# EAGLE design Zio Qwiic Relay (EAGLE 9.1.1)
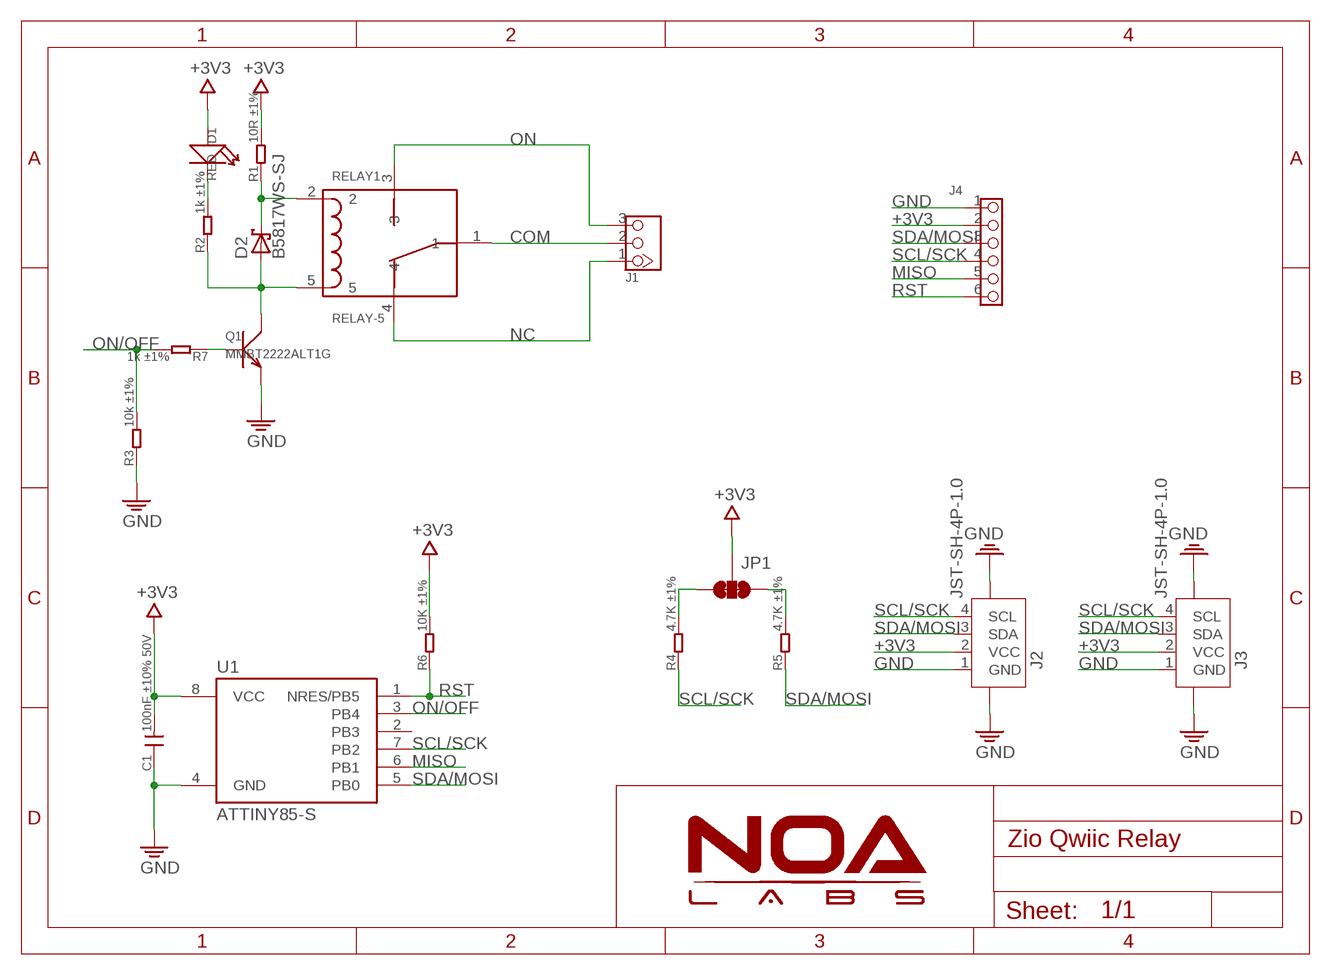
[diagram p0: schematic, sheet 1]

## Parts
C1  100nF ±10% 50V  C-0603  [C0603]
D1  RED  LED'0603'  [LED-0603]
D2  B5817WS-SJ  SCHOTTKY-SOD323  [SOD323]
J1  HEADER-3P  [3P-SCREW-5.08]
J2  JST-SH-4P-1.0  [JST-SH-4P]
J3  JST-SH-4P-1.0  [JST-SH-4P]
J4  HEADER-6P-60/35MIL  [6P-2.54-60/35MIL]
JP1  SMT-JUMPER_3_2-NC_TRACE  [SMT-JUMPER_3_2-NC_TRACE]
Q1  MMBT2222ALT1G  TRANSISTOR-NPN-SOT23''  [SOT23]
R1  10R ±1%  R-0603  [R0603]
R2  1k ±1%  R-0603  [R0603]
R3  10k ±1%  R-0603  [R0603]
R4  4.7K ±1%  R-0603  [R0603]
R5  4.7K ±1%  R-0603  [R0603]
R6  10K ±1%  R-0603  [R0603]
R7  1k ±1%  R-0603  [R0603]
RELAY1  RELAY-5  [RELAY-5]
U1  ATTINY85-S  [SOIC8_EIAJ_208MIL]

## Nets
+3V3: C1.2 D1.+ J2.2(VCC) J3.2(VCC) J4.2 JP1.2 R1.2 R6.2 U1.8(VCC)
COM: J1.2 RELAY1.1
GND: C1.1 J2.1(GND) J2.NC1 J2.NC2 J3.1(GND) J3.NC1 J3.NC2 J4.1 Q1.2(E) R3.1 U1.4(GND)
MISO: J4.5 U1.6(PB1)
N$1: D2.-(C) R1.1 RELAY1.2
N$2: Q1.1(B) R7.1
N$3: D1.- R2.2
N$4: D2.+(A) Q1.3(C) R2.1 RELAY1.5
N$6: JP1.3 R4.2
N$8: JP1.1 R5.2
NC: J1.1 RELAY1.4
ON: J1.3 RELAY1.3
ON/OFF: R3.2 R7.2 U1.3(PB4)
RST: J4.6 R6.1 U1.1(NRES/PB5)
SCL/SCK: J2.4(SCL) J3.4(SCL) J4.4 R4.1 U1.7(PB2)
SDA/MOSI: J2.3(SDA) J3.3(SDA) J4.3 R5.1 U1.5(PB0)
Unconnected: U1.2(PB3)

## Library data of the parts
C1 = RCL:C
D1 = Discrete_NOA:LED*
D2 = Discrete_NOA:SCHOTTKY
J1 = Connector_NOA:HEADER-3P
J2 J3 = Connector:JST-SH-4P
J4 = Connector_NOA:HEADER-6P
JP1 = NOA-Jumpers:SMT-JUMPER_3_2-NC_TRACE
Q1 = Discrete_NOA:TRANSISTOR-NPN*: NPN audion
R1-R7 = RCL:R
RELAY1 = Discrete:RELAY-5
U1 = IC:ATTINY85*: ATMEL ATtiny 85 Packages: P = PDIP 08 30mil S = SOIC 08 EIAJ 208mil Technologies Note: for complete ordering code (temp. range, finish, tape&reel etc.) see www.atmel.com • Supply Voltage: V = (1.8…5.5)V | [blank] = (2.7…5.5)V • Speed: 10 = 10 MHz | 20 = 20 MHz Author: Dipl.-Ing. FH Rainer Bayer HHN Hochschule Heilbronn (Heilbronn University), rainer.bayer@hs-heilbronn.de Ingenieurbüro ing-rb, mail@ing-rb.de

## Board
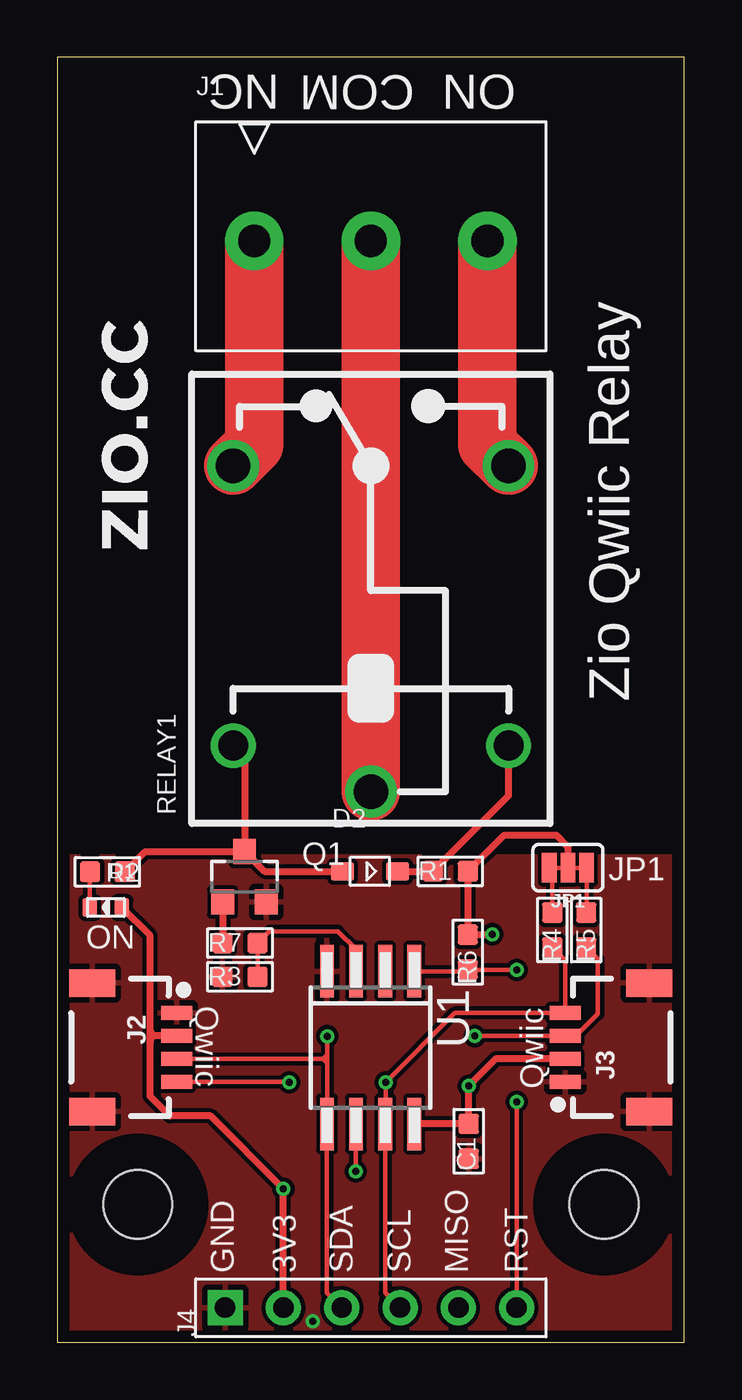
[diagram p1: board, top side]
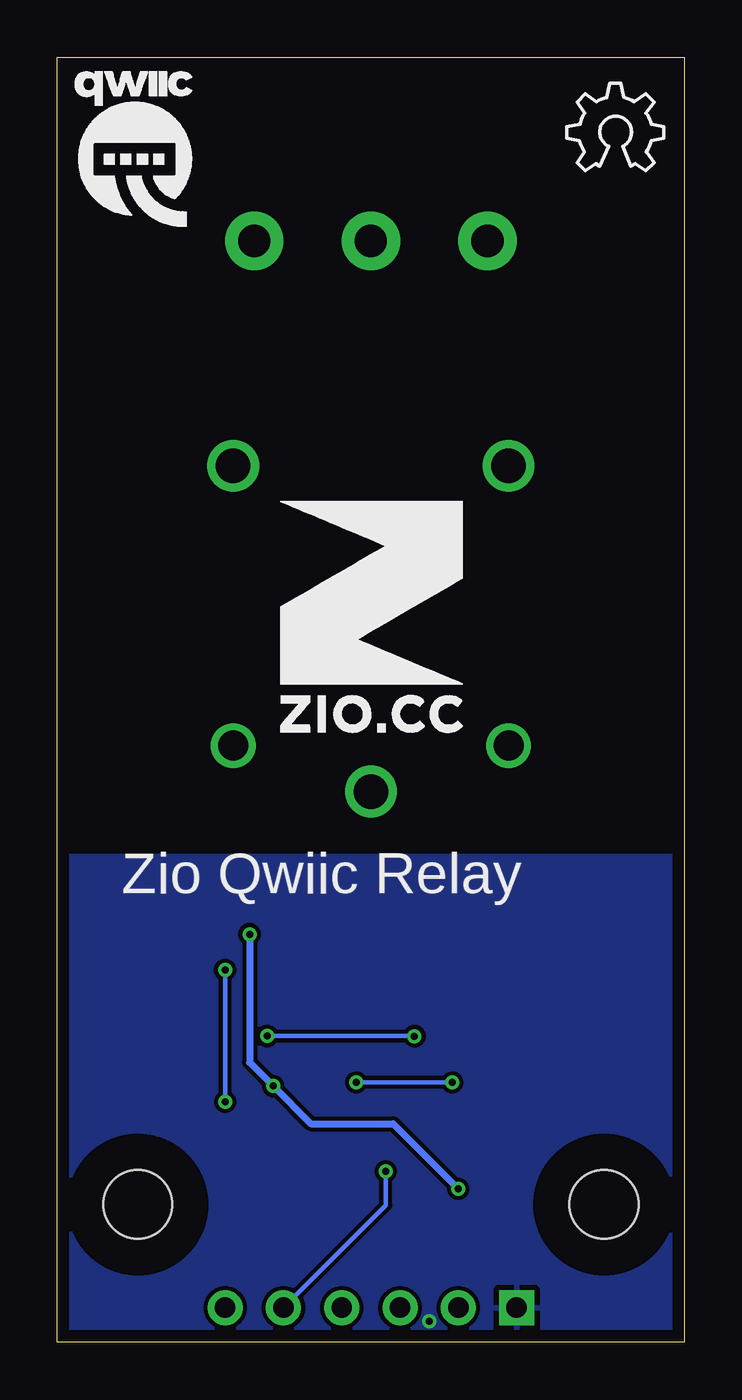
[diagram p2: board, bottom side, seen from below]

Size 27.32 x 56 mm. Coordinates in mm from the lower left corner, seen from the top.
Outline: 0,0 27.32,0 27.32,56 0,56 0,0
Copper layers (1*16): Top 0.035mm / dielectric 1.5mm / Bottom 0.035mm
Design rules "NOA Eagle Rule": minimum track width 7mil, minimum drill 12mil, track to track 7mil, track to pad 7mil, pad to pad 7mil, via to via 7mil, smd to smd 0mil, copper to edge 20mil, drill to drill 10mil, minimum pad ring 10mil, minimum via ring 6mil, stop-mask expansion 2mil, vias tented up to drill 25mil, thermal gap 10mil
Holes 3 mm at 3.5,6 23.82,6
tRestrict: area 0.5,3 to 6.5,9; area 20.8,3 to 26.8,9
bRestrict: area 0.5,3 to 6.5,9; area 20.8,3 to 26.8,9

### Footprints (pad centres in the part's own frame; a part is rotated, then mirrored left to right if it is on the bottom)
C0603 = smd 0.889 x 0.889: 1 -0.762,0; 2 0.762,0
LED-0603 = smd 0.635 x 0.8: + 0.699,0; - -0.699,0
SOD323 = smd 1 x 0.8: + -1.2,0; - 1.2,0
3P-SCREW-5.08 = drill 1.4 pad 2.54: 1 -5.08,0; 2 0,0; 3 5.08,0
JST-SH-4P = smd 0.6 x 1.35: 1 1.5,0; 2 0.5,0; 3 -0.5,0; 4 -1.5,0 | smd 1.2 x 2: NC1 -2.8,3.675; NC2 2.8,3.675
6P-2.54-60/35MIL = drill 0.889 pad 1.524 square: 1 0,6.35 | drill 0.889 pad 1.524: 2 0,3.81; 3 0,1.27; 4 0,-1.27; 5 0,-3.81; 6 0,-6.35
SMT-JUMPER_3_2-NC_TRACE = smd 0.635 x 1.27: 1 -0.813,0; 2 0,0; 3 0.813,0
SOT23 = smd 1 x 1.1: 1 -0.95,-1.1; 2 0.95,-1.1; 3 0,1.1
R0603 = smd 0.889 x 0.889: 1 -0.762,0; 2 0.762,0
RELAY-5 = drill 1.5: 1 0,0; 3 14.2,-6; 4 14.2,6 | drill 1.3: 2 2,-6; 5 2,6
SOIC8_EIAJ_208MIL = smd 0.6 x 2.286: 1 -1.905,-3.33; 2 -0.635,-3.33; 3 0.635,-3.33; 4 1.905,-3.33; 5 1.905,3.33; 6 0.635,3.33; 7 -0.635,3.33; 8 -1.905,3.33

### Placement (x,y rotation side)
C1  17.92,8.76 90 top
D1  2.11,18.95 0 top
D2  13.62,20.52 0 top
J1  13.66,48 0 top
J2  5.2,12.85 90 top
J3  22.12,12.85 270 top
J4  13.66,1.5 90 top
JP1  22.25,20.68 180 top
Q1  8.15,20.29 0 top
R1  17.12,20.52 0 top
R2  2.18,20.5 180 top
R3  7.96,15.92 0 top
R4  21.57,17.96 90 top
R5  23.04,17.96 90 top
R6  17.88,17 90 top
R7  7.96,17.39 0 top
RELAY1  13.66,24 90 top
U1  13.65,12.84 180 top
U$3  [10MM]  17.63,26.59 0 bottom
U$6  [QWIIC-LOGO-MEDIUM]  24,52.07 0 bottom
U$7  [OSHW_6X150_NOTEXT]  5.13,51.05 0 bottom
U$9  [2MM]  3.94,34.57 90 top

### Tracks (layer width: path | path; a pad name or v marks a point on that pad's centre or on a via)
+3V3  (via drill 0.3)
  Top 0.305: J3.2 19.11,12.35 v17.92,11.16 C1.2 15.56,9.52 U1.8 | 4.04,13.08 4.04,12.78 4.04,10.72 4.9,9.86 6.68,9.86 v9.85,6.68 J4.2 | 4.04,13.08 4.04,13.51 | 4.04,13.51 4.04,17.72 D1.+ | JP1.2 22.25,21.59 21.74,22.1 19.46,22.1 R1.2 R6.2 17.9,17.78 v18.95,17.78 | J2.2 4.2,13.35 | 4.2,13.35 4.04,13.51 | 4.2,13.35 4.04,13.19 4.04,13.08
  Bottom 0.305: v9.85,6.68 12.69,9.53 16.28,9.53 v17.92,11.16 18.95,12.19 v18.95,17.78
COM
  Top 2.54: J1.2 RELAY1.1
GND  (via drill 0.3)
  other vias: 11.13,0.91
  pour Bottom: 0,21.18 27.3,21.18 27.3,0 0,0
  pour Top: 0,21.18 27.3,21.18 27.3,0 0,0
MISO  (via drill 0.3)
  Top 0.203: v13.01,7.44 13.01,9.5 U1.6
  Bottom 0.203: J4.5 13.01,5.96 v13.01,7.44
N$1
  Top 0.305: D2.- R1.1 19.66,23.82 RELAY1.2
N$2
  Top 0.305: Q1.1 R7.1
N$3
  Top 0.203: D1.- R2.2
N$4
  Top 0.305: RELAY1.5 8.15,25.51 Q1.3 | R2.1 3.83,21.39 Q1.3 | Q1.3 9.02,20.52 D2.+
N$6
  Top 0.203: JP1.3 21.57,20.54 R4.2
N$8
  Top 0.203: JP1.1 23.06,18.74 R5.2
NC
  Top 2.54: J1.1 8.58,39.12 RELAY1.4
ON
  Top 2.54: J1.3 18.74,39.12 RELAY1.3
ON/OFF
  Top 0.203: U1.3 13.02,17.11 12.22,17.91 9.23,17.91 R7.2 R3.2
RST  (via drill 0.3)
  Top 0.203: U1.1 17.82,16.17 | 17.82,16.17 R6.1 | J4.6 v20.01,10.47 | 17.82,16.17 R6.1 v20.02,16.23
  Bottom 0.203: v20.01,10.47 v20.01,16.23 v20.02,16.23
SCL/SCK  (via drill 0.3)
  Top 0.203: U1.7 14.29,9.32 | 14.29,9.32 14.29,2.15 J4.4 | R4.1 22.12,16.65 J3.4 17.32,14.35 v14.3,11.33 14.3,9.34 14.29,9.32 | J2.4 10.09,11.35 v10.11,11.33
  Bottom 0.203: v10.11,11.33 v14.3,11.33
SDA/MOSI  (via drill 0.3)
  Top 0.203: J4.3 11.74,2.15 U1.5 11.76,9.53 11.76,12.17 | R5.1 23.55,16.7 23.55,14.3 22.6,13.35 J3.3 18.15,13.35 18.14,13.34 v18.17,13.34 v18.18,13.34 | v11.76,13.34 11.76,12.52 | 11.76,12.52 11.76,12.17 | J2.3 11.59,12.35 | 11.59,12.35 11.76,12.52 | 11.59,12.35 11.76,12.18 11.76,12.17
  Bottom 0.203: v18.18,13.34 v11.77,13.34 v11.76,13.34

### Text on the board
tPlace: NC | COM | ON | Zio Qwiic Relay | JP1 | ON | Qwiic | Qwiic | GND | 3V3 | SDA | SCL | MISO | RST
bPlace: Zio Qwiic Relay